# EAGLE schematic ppboard (EAGLE 6.5.0)
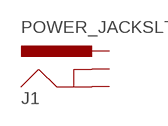
[diagram p0: schematic, sheet 1]

## Parts
J1  POWER_JACKSLT  [POWER_JACK_SLOT]
Unconnected: J1.GND@1(GNDBREAK) J1.GND@2(GND) J1.PWR

## Library data of the parts
J1 = SparkFun-Connectors:POWER_JACK: Power Jack This is the standard 5.5mm barrel jack for power. The PTH is the most common, proven, reliable, footprint. The Slot footprint only works if the mill layer is transmitted to the PCB fab house so be warned. Mating wall wart : TOL-00298 (and others); PROD_ID: PRT-00119